# Altium project ESP8266_UP.PrjPcb
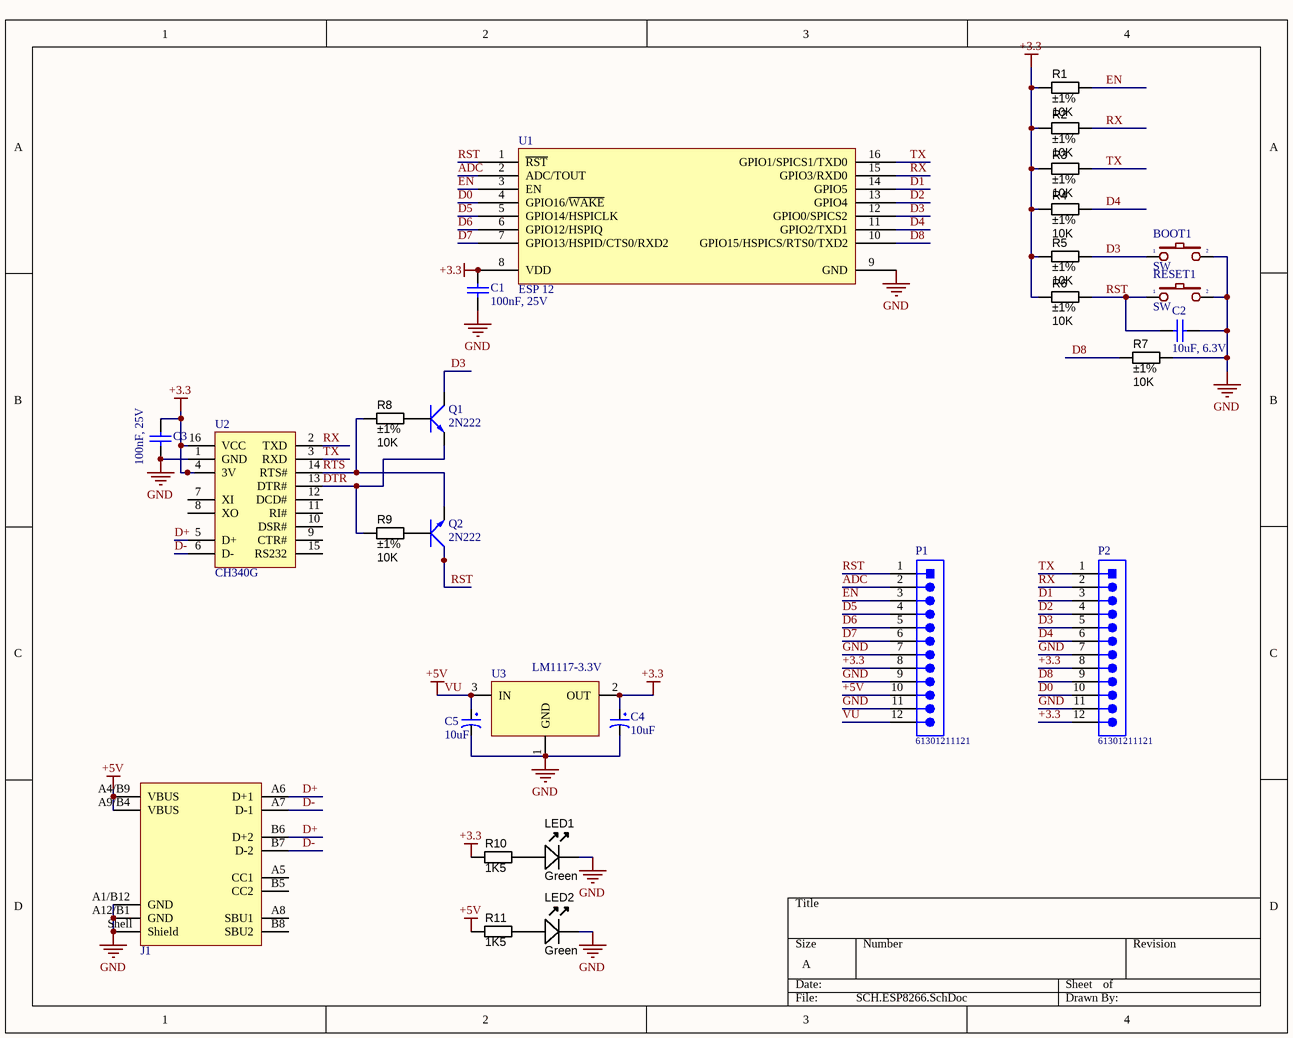
[diagram p0: SCH.ESP8266.SchDoc]
1 sheet, 28 parts. Net scope: global (net labels, ports and power ports of the same name join across sheets).
Board file: PCB.ESP8266.PcbDoc

## Sheet SCH.ESP8266.SchDoc
size A; SheetNumber: 1; SheetTotal: 1

### Parts
BOOT1  SW  [SW1-SMD]
C1  100nF, 25V  [WCAP-CSGP_0603_L1.6W0.8H0.8_Reflow]
C2  10uF, 6.3V  [WCAP-CSGP_0603_L1.6W0.8H0.8_Reflow]
C3  100nF, 25V  [WCAP-CSGP_0603_L1.6W0.8H0.8_Reflow]
C4  10uF  [tu tantalum smd3216]
C5  10uF  [tu tantalum smd3216]
J1  629722000214  [629722000214]  (value not drawn)
LED1  Green  [LED-0603-GREEN]
LED2  Green  [LED-0603-GREEN]
P1  61301211121  [61301211121]
P2  61301211121  [61301211121]
Q1  2N222  [SOT23-231]
Q2  2N222  [SOT23-231]
R1  value 10K  Tolerance: ±1%  [RESC1608X55N]  (hidden comment: Thick Film)
R2  value 10K  Tolerance: ±1%  [RESC1608X55N]  (hidden comment: Thick Film)
R3  value 10K  Tolerance: ±1%  [RESC1608X55N]  (hidden comment: Thick Film)
R4  value 10K  Tolerance: ±1%  [RESC1608X55N]  (hidden comment: Thick Film)
R5  value 10K  Tolerance: ±1%  [RESC1608X55N]  (hidden comment: Thick Film)
R6  value 10K  Tolerance: ±1%  [RESC1608X55N]  (hidden comment: Thick Film)
R7  value 10K  Tolerance: ±1%  [RESC1608X55N]  (hidden comment: Thick Film)
R8  value 10K  Tolerance: ±1%  [RESC1608X55N]  (hidden comment: Thick Film)
R9  value 10K  Tolerance: ±1%  [RESC1608X55N]  (hidden comment: Thick Film)
R10  value 1K5  [RESC1608X55N]  (hidden comment: Thick Film)
R11  value 1K5  [RESC1608X55N]  (hidden comment: Thick Film)
RESET1  SW  [SW1-SMD]
U1  ESP 12  [ESP12E]
U2  CH340G  [SO16]
U3  LM1117-3.3V  [SOT223]

### Nets
+3.3: C1.2 C3.2 C4.1 P1.8 P2.8 P2.12 R1.1 R2.1 R3.1 R4.1 R5.1 R6.1 R10.1 U1.8(VDD) U2.4(3V) U2.16(VCC) U3.2(OUT)
+5V: C5.1 J1.A4/B9(VBUS) J1.A9/B4(VBUS) P1.10 P1.12 R11.1 U3.3(IN)  [also labelled VU]
GND: BOOT1.2 C1.1 C2.2 C3.1 C4.2 C5.2 J1.A1/B12(GND) J1.A12/B1(GND) J1.Shell(Shield) LED1.K LED2.K P1.7 P1.9 P1.11 P2.7 P2.11 R7.1 RESET1.2 U1.9(GND) U2.1(GND) U3.1(GND)
ADC: P1.2 U1.2(ADC/TOUT)
D0: P2.10 U1.4(GPIO16/~{WAKE})
D1: P2.3 U1.14(GPIO5)
D2: P2.4 U1.13(GPIO4)
D3: BOOT1.1 P2.5 Q1.3(C) R5.2 U1.12(GPIO0/SPICS2)
D4: P2.6 R4.2 U1.11(GPIO2/TXD1)
D5: P1.4 U1.5(GPIO14/HSPICLK)
D6: P1.5 U1.6(GPIO12/HSPIQ)
D7: P1.6 U1.7(GPIO13/HSPID/CTS0/RXD2)
D8: P2.9 R7.2 U1.10(GPIO15/HSPICS/RTS0/TXD2)
D+: J1.A6(D+1) J1.B6(D+2) U2.5(D+)
D-: J1.A7(D-1) J1.B7(D-2) U2.6(D-)
DTR: Q1.1(E) R9.1 U2.13(DTR#)
EN: P1.3 R1.2 U1.3(EN)
RST: C2.1 P1.1 Q2.3(C) R6.2 RESET1.1 U1.1(~{RST})
RTS: Q2.1(E) R8.1 U2.14(RTS#)
RX: P2.2 R2.2 U1.15(GPIO3/RXD0) U2.2(TXD)
TX: P2.1 R3.2 U1.16(GPIO1/SPICS1/TXD0) U2.3(RXD)
NetLED1_A: LED1.A R10.2
NetLED2_A: LED2.A R11.2
NetQ1_2: Q1.2(B) R8.2
NetQ2_2: Q2.2(B) R9.2

Not connected (* = marked no-connect by the designer): J1 A5(CC1) A8(SBU1) B5(CC2) B8(SBU2); U2 7(XI) 8(XO) 9(CTR#) 10(DSR#) 11(RI#) 12(DCD#) 15(RS232)

### Library data of the parts
BOOT1 RESET1 = SW2: Switch button 2 pin; Value: SW chip 2 pin
C1 C3 = 885012206071: WCAP-CSGP Multilayer Ceramic Chip Capacitor, General Purpose, size 0603, X7R, 100nF, 25V; Manufacturer: Wurth Elektronik; Capacitance Tolerance: +/-10%; Dissipation Factor: 3.5%; Isolation Resistance: 5GOhm; Technical Reference: X7R0603104K025DFCT10000; Capacitance: 100nF; Ceramic Type: X7R; ComponentLink1Description: Manufacturer Link; ComponentLink1URL: http://www.we-online.de; ComponentLink2Description: Datasheet; ComponentLink2URL: https://www.we-online.com/catalog/datasheet/885012206071.pdf; Height: 0.8mm; Length: 1.6mm; Manufacturer Part Number: 885012206071; Mounting Technology: SMT; Operating Temperature max.: 125C; Operating Temperature min.: -55C; Packaging: Tape and Reel; Rated Voltage: 25V; Size: 0603; Width: 0.8mm
C2 = 885012106006: WCAP-CSGP Multilayer Ceramic Chip Capacitor, General Purpose, size 0603, X5R, 10uF, 6.3V; Manufacturer: Wurth Elektronik; Capacitance Tolerance: +/-20%; Dissipation Factor: 10%; Isolation Resistance: 0.01GOhm; Technical Reference: X5R0603106M6R3DFCT10000; Capacitance: 10uF; Ceramic Type: X5R; ComponentLink1Description: Manufacturer Link; ComponentLink1URL: http://www.we-online.de; ComponentLink2Description: Datasheet; ComponentLink2URL: https://www.we-online.com/catalog/datasheet/885012106006.pdf; Height: 0.8mm; Length: 1.6mm; Manufacturer Part Number: 885012106006; Mounting Technology: SMT; Operating Temperature max.: 85C; Operating Temperature min.: -55C; Packaging: Tape and Reel; Rated Voltage: 6.3V; Size: 0603; Width: 0.8mm
C4 C5 = Tu tantalum 10uF 16V SMD3216: Dán; Don_Vi: Con; So_Chan: 2; Ten_Linh_Kien: Tụ tantalum 106C-10uF 16V SMD3216; Ma_Hang: MH001954; Chung_Loai: Dán; Kieu_Chan: *
J1 = 629722000214: WR-COM USB 2.0 Type C Receptacle Horizontal SMT; Manufacturer: Wurth Elektronik; Match Code: WR-USB; Interface Type: Type C; Number of Ports: 1; Rated Current: 5A; Working Voltage: 20V (DC); Manufacturer Part Number: 629722000214; Category: Input/Output Connectors; ComponentLink1Description: Website Link; ComponentLink1URL: https://www.we-online.com/redexpert/article/629722000214?ad; ComponentLink2Description: Datasheet Link; ComponentLink2URL: https://www.we-online.com/redexpert/spec/629722000214?ad; Mount: Surface Mount; Operating Temperature Max: 85°C; Operating Temperature Min: -40°C; Packaging: Tape and Reel; Application: USB 2.0; Gender: Receptacle; Number of Pins: 16; Orientation: Horizontal
LED1 LED2 = LED_SMD_Green_0603_525nm_350mcd: LED 0603 SMD Green 525nm 350mcd 20mA; Manufacturer 1: Kingbright; Manufacturer Part Number 1: APT1608ZGCK; Material: InGaN; Ratings: 200mcd min; 350 mcd typ @ 20mA; Voltage - Forward (Vf) @ 10mA: 3.1V; Viewing Angle: 120°; Lens Style/Size: Rectangle with Flat Top, 1.2mm x 0.8mm; Voltage - Forward (Vf) @ 20mA: 3.3V; SCDType: source; Package / Case: 0603 (1608 metric); Color: Green; Current - Test: 20mA; Manufacturer 2: Kingbright Company LLC; Manufacturer Part Number 2: APT1608-WAP24; Supplier 1: Mouser; Supplier Part Number 1: 604-APT1608ZGCK; ComponentLink1URL: http://www.mouser.com/ds/2/216/APT1608ZGCK-262051.pdf; ComponentLink1Description: http://www.mouser.com/ds/2/216/APT1608ZGCK-262051.pdf; ComponentLink2Description: APT1608-WAP24 Datasheet; ComponentLink2URL: \\SVFI2\PBLShare\Eng\Electrical Engineering\Hardware\Altium\Libraries and Templates\Unreleased Components\Part Number Request 2013-10-02\APT1608-WAP24(Ver.1B).pdf
P1 P2 = 61301211121: WR-PHD Pin Header, THT, pitch 2.54mm, Single Row, Vertical, 12p; Manufacturer: Wurth Elektronik; Pin Number: 12; Rated Current: 3A; Working Voltage: 250VAC; Withstanding Voltage: 500VAC; Contact Resistance: 20mOhm; ComponentLink1Description: Manufacturer; ComponentLink1URL: http://www.we-online.de; ComponentLink2Description: Datasheet; ComponentLink2URL: https://www.we-online.com/catalog/datasheet/61301211121.pdf; Manufacturer Part Number: 61301211121; Pitch: 2.54mm; Operating Temperature: -40 to +105degC; Mounting Technology: THT; Packaging: Bag; Gender: Pin Header; Row Number: Single; Orientation: Vertical
Q1 Q2 = 2N222: NPN 600mW, ECB; Value: C1815
R1-R9 = RES_10K_0603_1%: Resistor SMD chip 10k Ohm 0.1W 1% 0603; Manufacturer 1: Yageo; Manufacturer Part Number 1: RC0603FR-0710KL; Ratings: 1/10W; SCDType: spec; Package / Case: 0603 (1608 Metric); Supplier 1: Digi-Key; Supplier Part Number 1: 311-10.0KHRCT-ND
R10 R11 = RES_1K5_0603_5%: Resistor SMD chip 1.5k Ohm 0.1W 5% 0603; Manufacturer 1: Yageo; Manufacturer Part Number 1: RC0603JR-071K5L; Ratings: 1/10 W; SCDType: spec; Package / Case: 0603 (1608 metric); Tolerance: ±5%; Material: thick film; Supplier 1: Digi-Key; Supplier Part Number 1: 311-1.5KGRCT-ND
U1 = ESP_12: Vendor: Ai-thinker; IC: ESP8266-EX
U2 = CH340G: High and Low Side Driver; Note: Pins 4, 8 and 14 are not connected; Published: 8-Jun-2000; LatestRevisionDate: 04-Mar-2005; LatestRevisionNote: Stylized 3D Model Added.; DatasheetVersion: PD60147J; PackageReference: PDIP14; Publisher: Altium Limited; PackageDescription: DIP; 14 Leads; Row Spacing 7.62 mm; Pitch 2.54 mm; ComponentLink1Description: Manufacturer Link; ComponentLink1URL: http://www.irf.com/; ComponentLink2Description: Datasheet; ComponentLink2URL: http://www.irf.com/product-info/datasheets/data/ir2110.pdf
U3 = LM1117: 800mA Low-Dropout Linear Regulator; Creator: Nguyen Ba Bien; Website: http://group3i.net